# Altium schematic sheet FLASH.SchDoc
size A; Organization: Altium Limited; Address1: L3, 12a Rodborough Rd; Address2: Frenchs Forest; Address3: NSW; Address4: Australia 2086
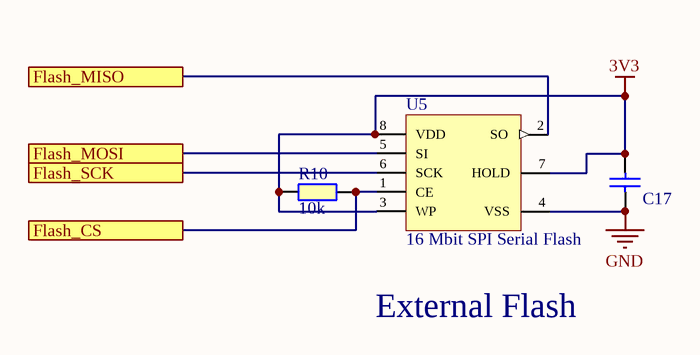
[diagram p0: FLASH.SchDoc]

## Parts
C17  0.01uF  [C_0603]  (value not drawn)
R10  10k  [R_0603]
U5  16 Mbit SPI Serial Flash  [SOIC127P790X216-8N]

## Ports
Flash_CS, Flash_MISO, Flash_MOSI, Flash_SCK

## Nets
3V3: C17.2 R10.2 U5.3(WP) U5.7(HOLD) U5.8(VDD)
GND: C17.1 U5.4(VSS)
Flash_CS: R10.1 U5.1(CE) ; port Flash_CS
Flash_MISO: U5.2(SO) ; port Flash_MISO
Flash_MOSI: U5.5(SI) ; port Flash_MOSI
Flash_SCK: U5.6(SCK) ; port Flash_SCK

## Notes on the sheet
- External Flash
- Title
- Size:
- Date:
- A
- Number:
- Time:
- Revision:
- Sheet
- of
- File:

## Library data of the parts
C17 = CAP_0603
R10 = RES_0603
U5 = SST25VF016B: MPN: SST25VF016B-50-4I-S2AF; OC_FARNELL: 1368695; OC_NEWARK: 82R4471; PACKAGE: SOIC-8; SUPPLIER: SILICON STORAGE TECHNOLOGY